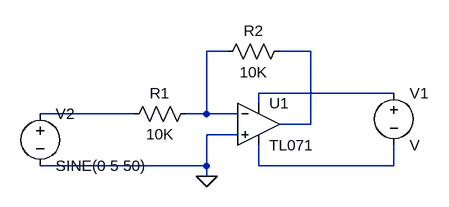
[diagram p0: schematic test-tl071.asc]
test-tl071.asc, the LTspice schematic file:
Version 4
SHEET 1 880 680
WIRE 80 16 48 16
WIRE 208 16 160 16
WIRE 336 80 128 80
WIRE 128 96 128 80
WIRE -64 112 -208 112
WIRE 48 112 48 16
WIRE 48 112 16 112
WIRE 96 112 48 112
WIRE 208 128 208 16
WIRE 208 128 160 128
WIRE 96 144 48 144
WIRE 48 192 48 144
WIRE 48 192 -208 192
WIRE 128 192 128 160
WIRE 336 192 336 160
WIRE 336 192 128 192
WIRE 48 208 48 192
FLAG 48 208 0
SYMBOL TL071 128 64 R0
SYMATTR InstName U1
SYMBOL res 32 96 R90
WINDOW 0 0 56 VBottom 2
WINDOW 3 32 56 VTop 2
SYMATTR InstName R1
SYMATTR Value 10K
SYMATTR SpiceLine tol=1 pwr=0.1
SYMBOL res 176 0 R90
WINDOW 0 0 56 VBottom 2
WINDOW 3 32 56 VTop 2
SYMATTR InstName R2
SYMATTR Value 10K
SYMATTR SpiceLine tol=1 pwr=0.1
SYMBOL voltage 336 64 R0
SYMATTR InstName V1
SYMBOL voltage -208 96 R0
WINDOW 123 0 0 Left 0
WINDOW 39 0 0 Left 0
SYMATTR InstName V2
SYMATTR Value SINE(0 5 50)

The netlist it stands for:
* test-tl071.asc
* U1: TL071 (symbol TL071 not available, pins judged from their places): In+=0 In-=N001 V+=N003 V-=N005 OUT=N002
R1 N001 N004 10K tol=1 pwr=0.1
R2 N002 N001 10K tol=1 pwr=0.1
V1 N003 N005 V
V2 N004 0 SINE(0 5 50)
.backanno
.end